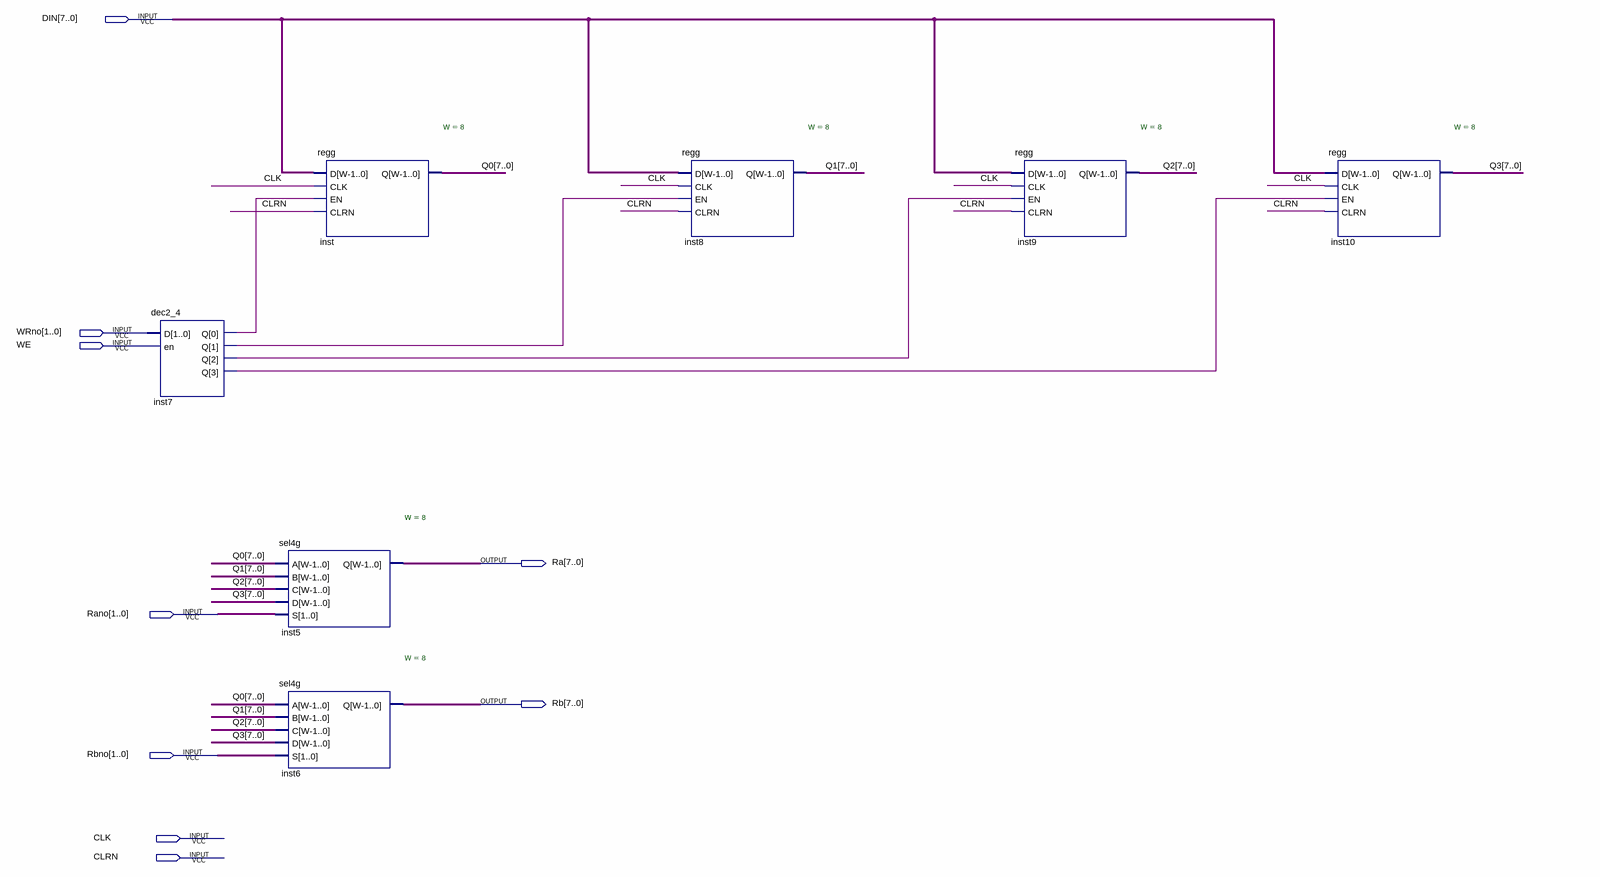
[diagram p0: schematic sheet]
// Quartus schematic regset.bdf as structural Verilog: 7 symbols, 9 pins
module regset (
  input  [7:0] DIN,
  input  [1:0] WRno,
  input  WE,
  input  [1:0] Rano,
  input  [1:0] Rbno,
  input  CLK,
  input  CLRN,
  output [7:0] Ra,
  output [7:0] Rb
);

  wire inst7_q, inst7_q_2, inst7_q_3, inst7_q_4;
  wire [7:0] Q0, Q1, Q2, Q3;

  dec2_4 inst7 (.D(WRno), .en(WE), .Q({inst7_q_4, inst7_q_3, inst7_q_2, inst7_q}));
  sel4g #(.W(8)) inst5 (.A(Q0), .B(Q1), .C(Q2), .D(Q3), .S(Rano), .Q(Ra));
  sel4g #(.W(8)) inst6 (.A(Q0), .B(Q1), .C(Q2), .D(Q3), .S(Rbno), .Q(Rb));
  regg #(.W(8)) inst (.D(DIN), .CLK(CLK), .EN(inst7_q), .CLRN(CLRN), .Q(Q0));
  regg #(.W(8)) inst8 (.D(DIN), .CLK(CLK), .EN(inst7_q_2), .CLRN(CLRN), .Q(Q1));
  regg #(.W(8)) inst9 (.D(DIN), .CLK(CLK), .EN(inst7_q_3), .CLRN(CLRN), .Q(Q2));
  regg #(.W(8)) inst10 (.D(DIN), .CLK(CLK), .EN(inst7_q_4), .CLRN(CLRN), .Q(Q3));
endmodule
